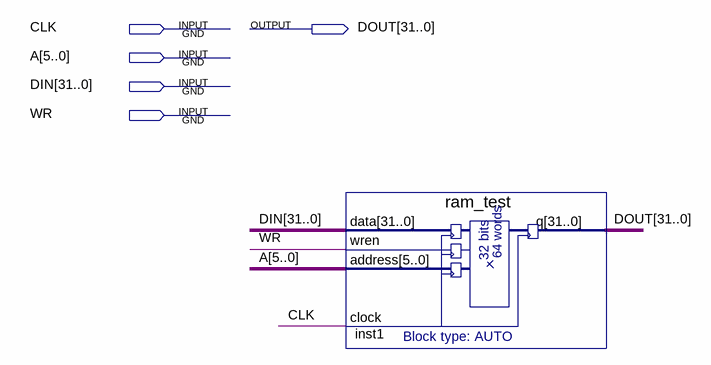
[diagram p0: schematic sheet]
// Quartus schematic RAM_controler.bdf as structural Verilog: 1 symbols, 5 pins
module RAM_controler (
  input  CLK,
  input  [5:0] A,
  input  [31:0] DIN,
  input  WR,
  output [31:0] DOUT
);

  ram_test inst1 (.data(DIN), .wren(WR), .address(A), .clock(CLK), .q(DOUT));
endmodule
